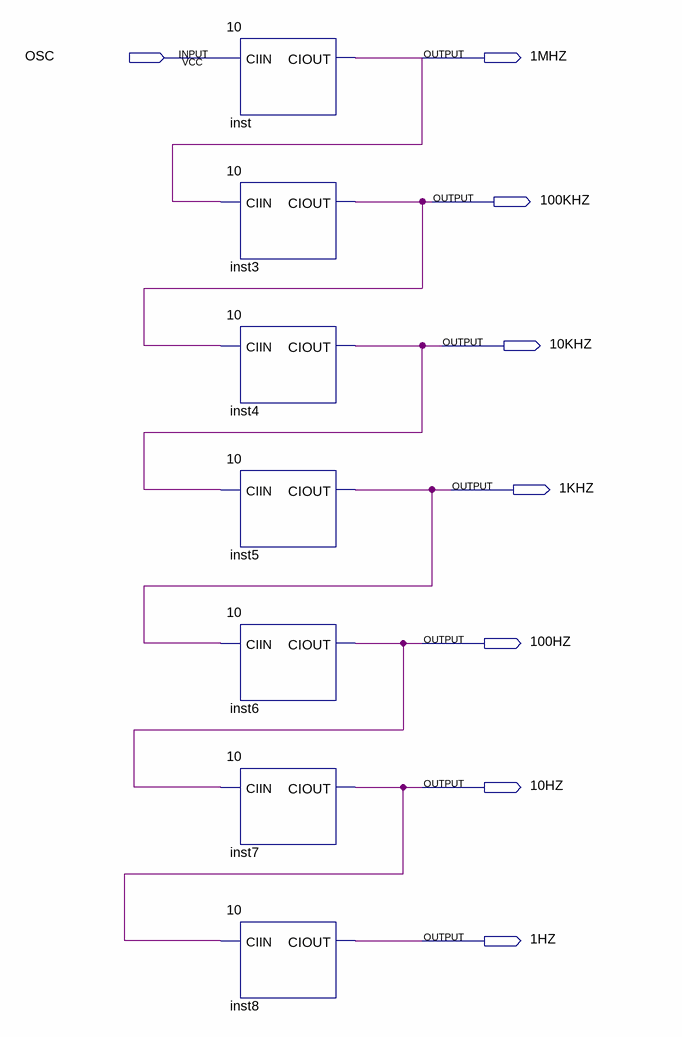
[diagram p0: schematic sheet]
// Quartus schematic 7_10.bdf as structural Verilog: 7 symbols, 8 pins
module \7_10  (
  input  OSC,
  output \1MHZ ,
  output \100KHZ ,
  output \10KHZ ,
  output \1KHZ ,
  output \100HZ ,
  output \10HZ ,
  output \1HZ 
);

  \10  inst (.CIIN(OSC), .CIOUT(\1MHZ ));
  \10  inst3 (.CIIN(\1MHZ ), .CIOUT(\100KHZ ));
  \10  inst4 (.CIIN(\100KHZ ), .CIOUT(\10KHZ ));
  \10  inst5 (.CIIN(\10KHZ ), .CIOUT(\1KHZ ));
  \10  inst6 (.CIIN(\1KHZ ), .CIOUT(\100HZ ));
  \10  inst7 (.CIIN(\100HZ ), .CIOUT(\10HZ ));
  \10  inst8 (.CIIN(\10HZ ), .CIOUT(\1HZ ));
endmodule
